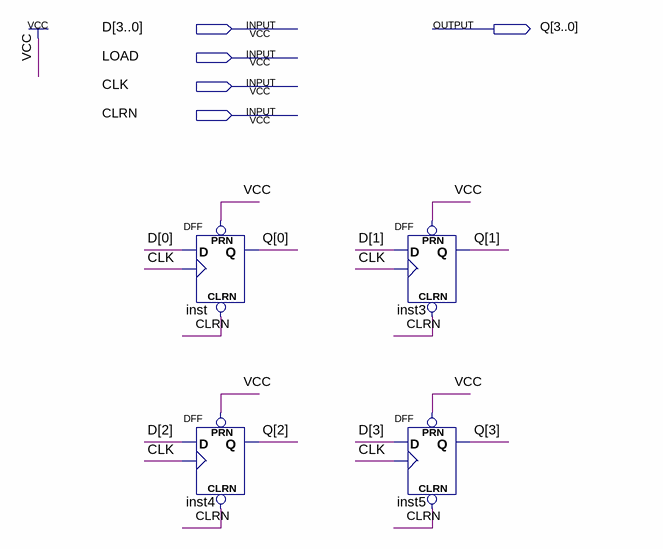
[diagram p0: schematic sheet]
// Quartus schematic 4BitRegister.bdf as structural Verilog: 4 symbols, 5 pins
module \4BitRegister  (
  input  [3:0] D,
  input  LOAD,
  input  CLK,
  input  CLRN,
  output [3:0] Q
);

  DFF inst (.CLRN(CLRN), .CLK(CLK), .D(D[0]), .PRN(1'b1), .Q(Q[0]));
  DFF inst4 (.CLRN(CLRN), .CLK(CLK), .D(D[2]), .PRN(1'b1), .Q(Q[2]));
  DFF inst3 (.CLRN(CLRN), .CLK(CLK), .D(D[1]), .PRN(1'b1), .Q(Q[1]));
  DFF inst5 (.CLRN(CLRN), .CLK(CLK), .D(D[3]), .PRN(1'b1), .Q(Q[3]));
endmodule
